# EAGLE design geiger2 (EAGLE 7.5.0)
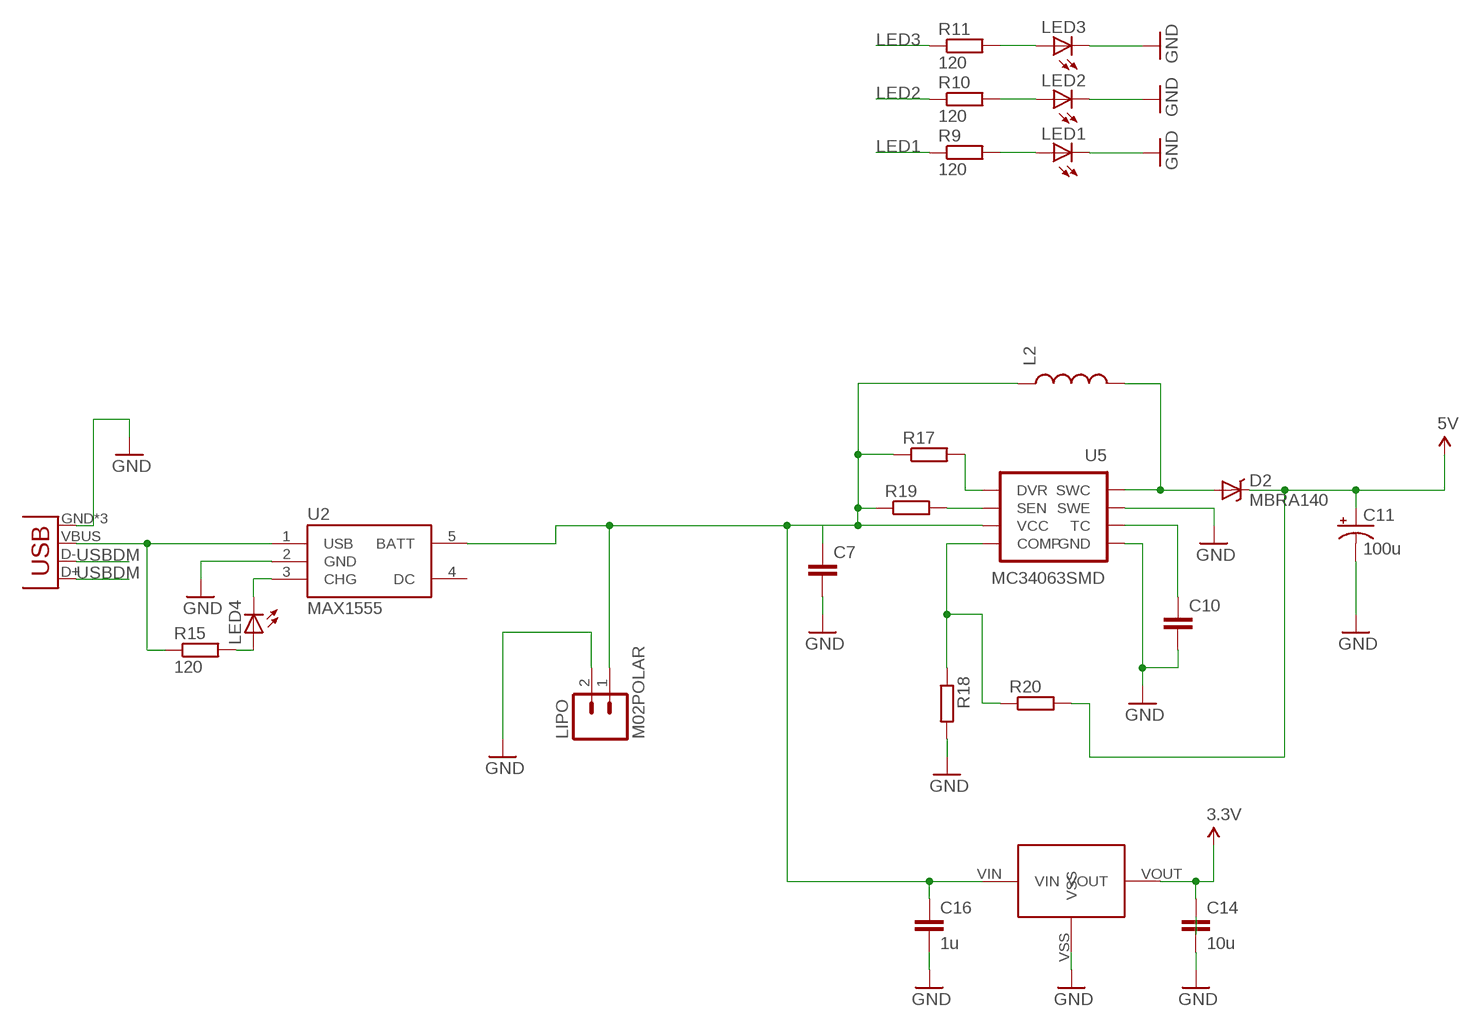
[diagram p0: schematic, sheet 1, part 1 of 2]
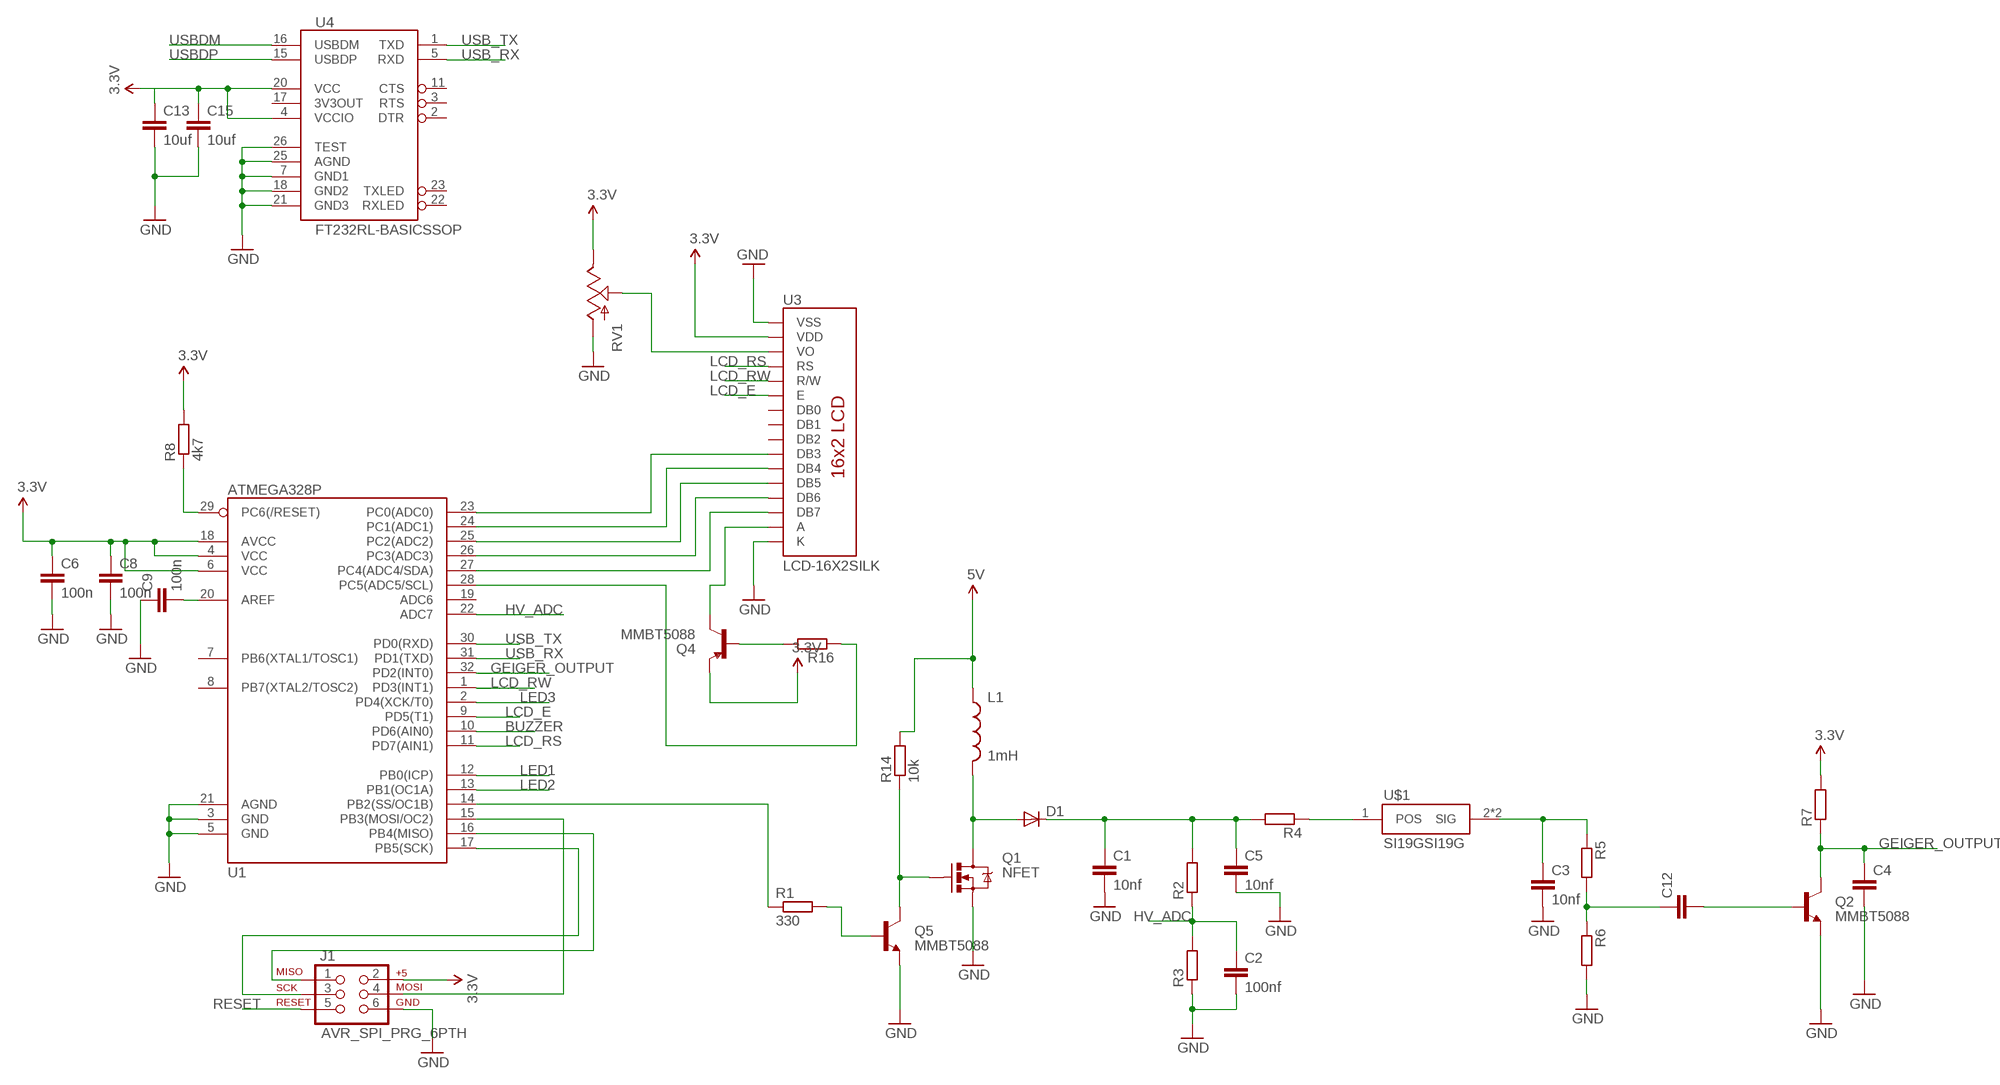
[diagram p1: schematic, sheet 1, part 2 of 2]

## Parts
C1  10nf  C-EU075-032X103  [C075-032X103]
C2  100nf  C-EUC0603  [C0603]
C3  10nf  C-EU075-032X103  [C075-032X103]
C4  C-EUC0603  [C0603]
C5  10nf  C-EU075-032X103  [C075-032X103]
C6  100n  C-EUC0603  [C0603]
C7  C-EUC0805  [C0805]
C8  100n  C-EUC0603  [C0603]
C9  100n  C-EUC0603  [C0603]
C10  C-EUC0603  [C0603]
C11  100u  CAP_POLF80  [NIPPON_F80]
C12  C-EUC0603  [C0603]
C13  10uf  C-EUC0603  [C0603]
C14  10u  C-EUC0603  [C0603]
C15  10uf  C-EUC0603  [C0603]
C16  1u  C-EUC0603  [C0603]
D1  DIODEPTH  [DIODE-1N4001]
D2  MBRA140  [SMA-DIODE]
J1  AVR_SPI_PRG_6PTH  [2X3]
JP2  USB-MICROB  [USB-MICROB]
L1  1mH  INDUCTORRLB0912  [RLB0912]
L2  INDUCTORCR75_V2  [CR75_V2]
LED1  LED0603  [LED-0603]
LED2  LED0603  [LED-0603]
LED3  LED0603  [LED-0603]
LED4  LED0603  [LED-0603]
LIPO  M02POLAR  [MOLEX-1X2]
Q1  NFET  MOSFET-NCHANNELFDD8780  [DPAK]
Q2  MMBT5088  TRANSISTOR_NPNMMBT5088  [SOT23]
Q4  MMBT5088  TRANSISTOR_PNPSMD  [SOT23-3]
Q5  MMBT5088  TRANSISTOR_NPNMMBT5088  [SOT23]
R1  330  R-EU_R0603  [R0603]
R2  R-EU_0207/10  [0207/10]
R3  R-EU_0207/10  [0207/10]
R4  R-EU_0207/10  [0207/10]
R5  R-EU_0207/10  [0207/10]
R6  R-EU_0207/10  [0207/10]
R7  R-EU_R0603  [R0603]
R8  4k7  R-EU_R0603  [R0603]
R9  120  R-EU_R0603  [R0603]
R10  120  R-EU_R0603  [R0603]
R11  120  R-EU_R0603  [R0603]
R14  10k  R-EU_R0603  [R0603]
R15  120  R-EU_R0603  [R0603]
R16  R-EU_R0603  [R0603]
R17  R-EU_R0603  [R0603]
R18  R-EU_R0603  [R0603]
R19  R-EU_R0603  [R0603]
R20  R-EU_R0603  [R0603]
RV1  POT100K_3362U  [3362U]
U1  ATMEGA328P  ATMEGA328_SMT  [TQFP32-08]
U2  MAX1555  [SOT23-5]
U3  LCD-16X2SILK  [LCD-16X2]
U4  FT232RL-BASICSSOP  [SSOP28DB]
U5  MC34063SMD  [SO08]
U$1  SI19GSI19G  [SI19G]
U$2  XC6026  [SOT23]

## Nets
3.3V: C6.1 C8.1 C13.1 C14.1 C15.1 J1.2 Q4.2(E) R7.2 R8.2 RV1.P$1(E) U1.4(VCC) U1.6(VCC) U1.18(AVCC) U3.2(VDD) U4.4(VCCIO) U4.20(VCC) U$2.VOUT
6V: C7.1 C16.1 L2.P$1 LIPO.1 R17.1 R19.1 U2.5(BATT) U5.6(VCC) U$2.VIN
12V: C11.+ D2.C L1.1 R14.2 R20.2 ; supply symbol labelled 5V
BUZZER: U1.10(PD6(AIN0))
GEIGER_OUTPUT: C4.1 Q2.3(C) R7.1 U1.32(PD2(INT0))
GND: C1.2 C2.2 C3.2 C4.2 C5.2 C6.2 C7.2 C8.2 C9.1 C10.2 C11.- C13.2 C14.2 C15.2 C16.2 J1.6 JP2.GND JP2.MT1(GND) JP2.MT2(GND) LED1.C LED2.C LED3.C LIPO.2 Q1.3(S) Q2.2(E) Q5.2(E) R3.1 R6.2 R18.2 RV1.P$3(A) U1.3(GND) U1.5(GND) U1.21(AGND) U2.2(GND) U3.1(VSS) U3.16(K) U4.7(GND1) U4.18(GND2) U4.21(GND3) U4.25(AGND) U4.26(TEST) U5.2(SWE) U5.4(GND) U$2.VSS
HV_ADC: C2.1 R2.1 R3.2 U1.22(ADC7)
LCD_E: U1.9(PD5(T1)) U3.6(E)
LCD_RS: U1.11(PD7(AIN1)) U3.4(RS)
LCD_RW: U1.1(PD3(INT1)) U3.5(R/W)
LED1: R9.1 U1.12(PB0(ICP))
LED2: R10.1 U1.13(PB1(OC1A))
LED3: R11.1 U1.2(PD4(XCK/T0))
N$1: D1.A L1.2 Q1.4(D)
N$2: R1.1 U1.14(PB2(SS/OC1B))
N$3: J1.1 U1.16(PB4(MISO))
N$4: Q5.1(B) R1.2
N$5: J1.3 U1.17(PB5(SCK))
N$6: J1.4 U1.15(PB3(MOSI/OC2))
N$7: C1.1 C5.1 D1.C R2.2 R4.2
N$8: R4.1 U$1.1(POS)
N$9: C3.1 R5.1 U$1.2(SIG) U$1.3(SIG)
N$10: C12.1 R5.2 R6.1
N$11: U1.23(PC0(ADC0)) U3.10(DB3)
N$12: C9.2 U1.20(AREF)
N$13: U1.24(PC1(ADC1)) U3.11(DB4)
N$14: U1.25(PC2(ADC2)) U3.12(DB5)
N$15: U1.26(PC3(ADC3)) U3.13(DB6)
N$16: U1.27(PC4(ADC4/SDA)) U3.14(DB7)
N$17: D2.A L2.P$2 U5.1(SWC)
N$18: RV1.P$2(S) U3.3(VO)
N$19: LED1.A R9.2
N$20: LED2.A R10.2
N$21: LED3.A R11.2
N$22: R18.1 R20.1 U5.5(COMP)
N$23: C12.2 Q2.1(B)
N$24: Q1.1(G) Q5.3(C) R14.1
N$25: Q4.1(B) R16.2
N$26: C10.1 U5.3(TC)
N$29: LED4.A R15.2
N$30: Q4.3(C) U3.15(A)
N$32: R16.1 U1.28(PC5(ADC5/SCL))
N$33: R17.2 U5.8(DVR)
N$34: R19.2 U5.7(SEN)
N$37: LED4.C U2.3(CHG)
N$38: JP2.VBUS R15.1 U2.1(USB)
RESET: J1.5 R8.1 U1.29(PC6(/RESET))
USB_RX: U1.31(PD1(TXD)) U4.5(RXD)
USB_TX: U1.30(PD0(RXD)) U4.1(TXD)
USBDM: JP2.D- U4.16(USBDM)
USBDP: JP2.D+ U4.15(USBDP)
Unconnected: U1.7(PB6(XTAL1/TOSC1)) U1.8(PB7(XTAL2/TOSC2)) U1.19(ADC6) U2.4(DC) U3.7(DB0) U3.8(DB1) U3.9(DB2) U4.2(DTR) U4.3(RTS) U4.11(CTS) U4.17(3V3OUT) U4.22(RXLED) U4.23(TXLED)

## Library data of the parts
C1-C10 C12-C16 = rcl:C-EU: CAPACITOR, European symbol
C11 = SparkFun-Capacitors:CAP_POL: Capacitor Polarized These are standard SMD and PTH capacitors. Normally 10uF, 47uF, and 100uF in electrolytic and tantalum varieties. Always verify the external diameter of the through hole cap, it varies with capacity, voltage, and manufacturer. The EIA devices should be standard.
D1 = SparkFun-DiscreteSemi:DIODE: Diode These are standard reverse protection diodes and small signal diodes. SMA package can handle up to about 1A. SOD-323 can handle about 200mA. What the SOD-323 package when ordering, there are some mfgs out there that are 5-pin packages.
D2 = SparkFun-DiscreteSemi:MBRA140: 40V, 1A Schottky rectifier SMA/DO-214AC package DIO-08053; PROD_ID: DIO-08053
J1 = SparkFun-Connectors:AVR_SPI_PRG_6: AVR ISP 6 Pin This is the reduced ISP connector for AVR programming. Common on Arduino. This footprint will take up less PCB space and can be used with a 10-pin to 6-pin adapter such as SKU: BOB-08508
JP2 = SparkFun-Connectors:USB: USB Connectors USB-B-PTH is fully proven SKU : PRT-00139/CONN-08278 USB-miniB is fully proven SKU : PRT-00587 USB-A-PCB is untested. USB-A-H is throughly reviewed, but untested. Spark Fun Electronics SKU : PRT-00437 USB-B-SMT is throughly reviewed, but untested. Needs silkscreen touching up. USB-A-S has not been used/tested USB-MB-H has not been used/tested USB-MICROB has been used. CONN-09505; PROD_ID: CONN-09505
L1 L2 = SparkFun-Passives:INDUCTOR: Inductors Basic Inductor/Choke - 0603 and 1206. Footprints are not proven and vary greatly between part numbers. SRN6045- 33uH, 20% 1.4A SDR0403-560KL - 56uH, 10%, 500mA RMS/740mA peak
LED1-LED4 = SparkFun-LED:LED: LEDs Standard schematic elements and footprints for 5mm, 3mm, 1206, and 0603 sized LEDs. 5mm - Spark Fun Electronics SKU : COM-00529 (and others)
LIPO = SparkFun-Connectors:M02: Standard 2-pin 0.1" header. Use with - straight break away headers ( PRT-00116) - right angle break away headers (PRT-00553) - swiss pins (PRT-00743) - machine pins (PRT-00117) - female headers (PRT-00115) Molex polarized connector foot print use with: PRT-08233 with associated crimp pins and housings. 2.54_SCREWTERM for use with PRT-10571. 3.5mm Screw Terminal footprints for PRT-08084 5mm Screw Terminal footprints for use with PRT-08433
Q1 = SparkFun-DiscreteSemi:MOSFET-NCHANNEL: Common NMOSFET Parts MFG P/N Store ID Prod ID FDD8780 TRANS-09984 SI7820DN TRANS-11055 FDS6630A IC-08089 2N7002PW TRANS-11151 FQP30N06L COM-10213 TRANS-10060 BSS123LT1G TRANS-08345 BSS138 TRANS-00830 BS170 2N7000; PROD_ID: TRANS-09984
Q2 Q5 = SparkFun-DiscreteSemi:TRANSISTOR_NPN: Generic NPN BJT MMBT2222A - TRANS-08049 (SOT-23, 1A 40V) MPSA42 - TRANS-09116 (SOT-23, 500mA 300V) MMBT5088LT1G - TRANS-11160 (SOT-23, 50 mA 30V); PROD_ID: TRANS-11160
Q4 = SparkFun-DiscreteSemi:TRANSISTOR_PNP: Generic PNP BJT Double check pinouts against datasheets- not all devices are the same! MMBT3906 - 40V 200mA SOT-23 (TRANS-08052) MMBT4403 - 40V 600mA SOT-23 (TRANS-09245)
R1-R11 R14-R20 = rcl:R-EU_: RESISTOR, European symbol
RV1 = SparkFun-Electromechanical:POT
U1 = SparkFun-DigitalIC:ATMEGA328_SMT: 32-Pin Atmega328 part Commonly used on Arduino compatible boards Available in QFP and QFN packages TQFP is IC-09069 QFN is non-stock; PROD_ID: IC-09069
U2 = SparkFun-PowerIC:MAX1555: MAX1555 Lithium Charger IC SOT-23 Lithium Polymer charging IC. Schematic element and footprint proven. Spark Fun Electronics SKU : COM-00674
U3 = SparkFun-Displays:LCD-16X2: Standard text-only 16x2 parallel input LCD
U4 = SparkFun-DigitalIC:FT232RL-BASIC: USB UART This is the simplified version of the FT232RL unit. Only what you need, nothing you don't. Spark Fun Electronics SKU : COM-00650
U5 = SparkFun-PowerIC:MC34063: Jellybean switching supply controller
U$1 = geiger_tubes:SI19G
U$2 = henriks_egne_pakker:XC6026

## Board
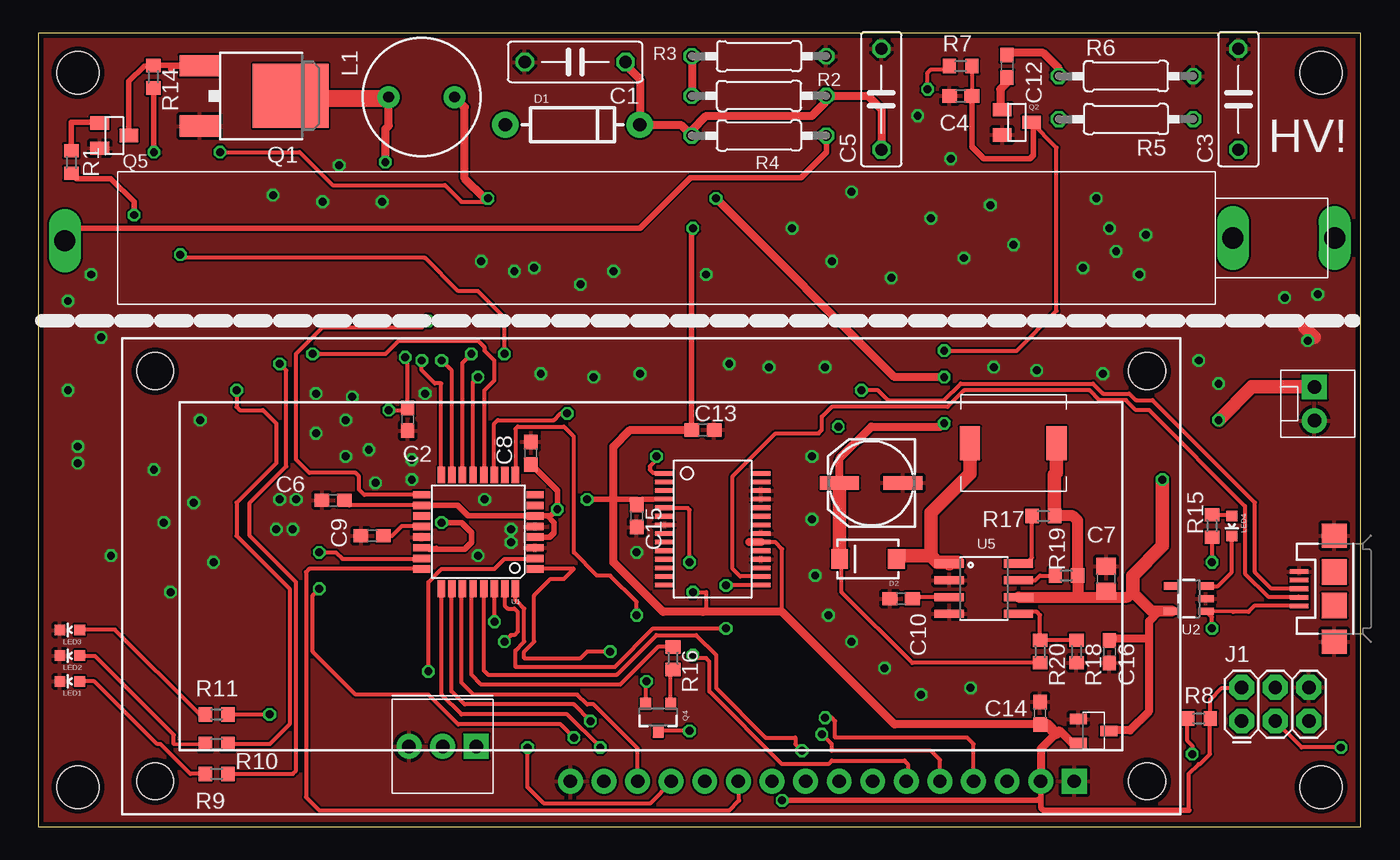
[diagram p2: board, top side]
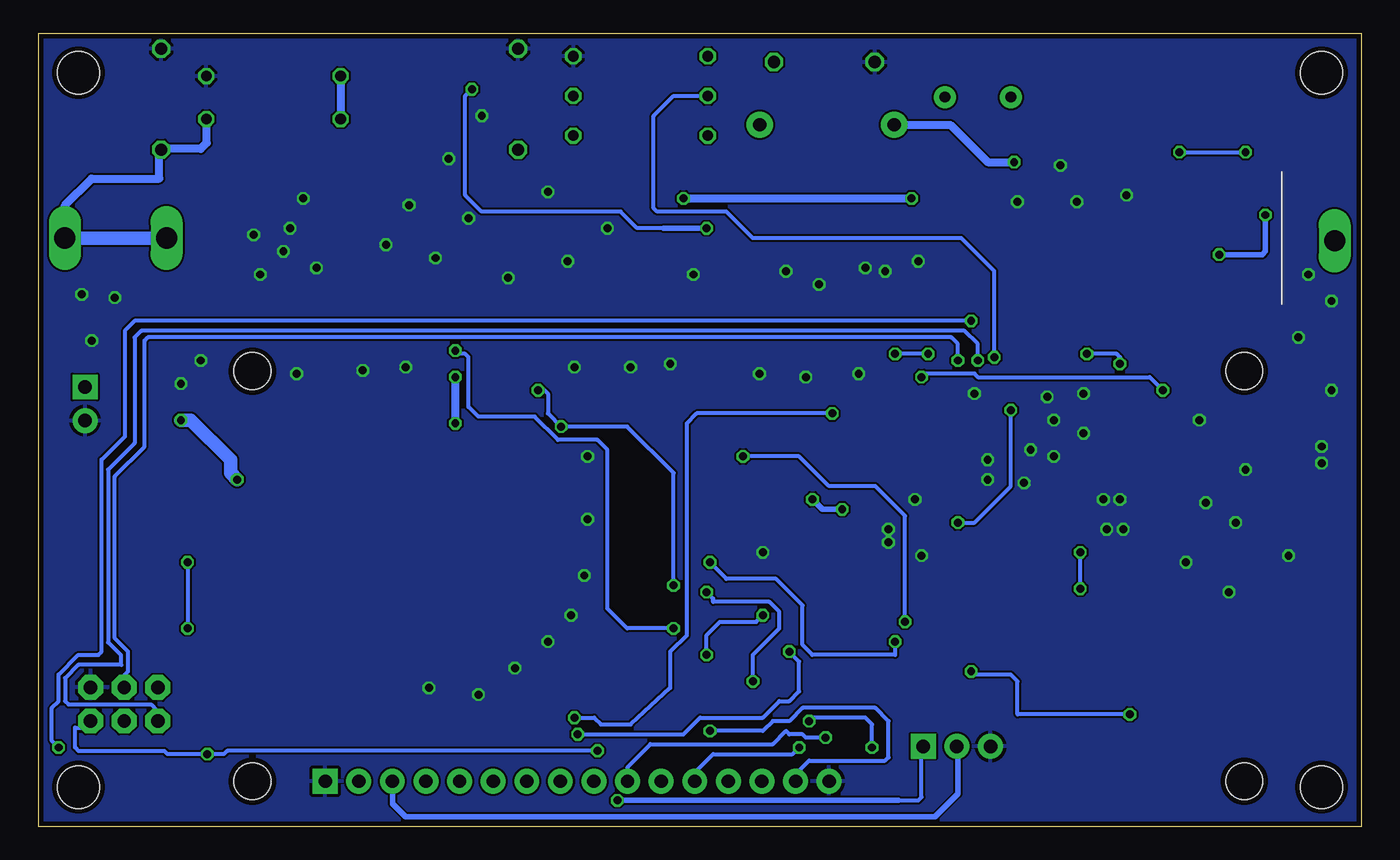
[diagram p3: board, bottom side, seen from below]

Size 100 x 60 mm. Coordinates in mm from the lower left corner, seen from the top.
Outline: 0,0 100,0 100,60 0,60 0,0
Copper layers (1*16): Top 0.0356mm / dielectric 1.5011mm / Bottom 0.0356mm
Design rules "osh_park": minimum track width 6mil, minimum drill 13mil, track to track 6mil, track to pad 6mil, pad to pad 6mil, via to via 6mil, smd to smd 6mil, copper to edge 15mil, drill to drill 6mil, minimum pad ring 7mil, minimum via ring 7mil, stop-mask expansion 3mil, vias tented up to drill 0mil, thermal gap 10mil
Holes 3.2 mm at 3,57 97,57 3,3 97,3

### Footprints (pad centres in the part's own frame; a part is rotated, then mirrored left to right if it is on the bottom)
C075-032X103 = drill 0.914 octagon: 1 -3.81,0; 2 3.81,0
C0603 = smd 1.1 x 1: 1 -0.85,0; 2 0.85,0
C0805 = smd 1.3 x 1.5: 1 -0.95,0; 2 0.95,0
NIPPON_F80 = smd 2.95 x 1: + 2.4,0; - -2.4,0
DIODE-1N4001 = drill 1 pad 1.981: A -5.08,0; C 5.08,0
SMA-DIODE = smd 1.27 x 1.47: A -2.15,0; C 2.15,0
2X3 = drill 1.016 pad 1.88 octagon: 1 0,0; 2 0,2.54; 3 2.54,0; 4 2.54,2.54; 5 5.08,0; 6 5.08,2.54
USB-MICROB = smd 0.35 x 1.4: D+ 0,2.65; D- -0.65,2.65; GND 1.3,2.65; ID 0.65,2.65; VBUS -1.3,2.65 | smd 1.8 x 1.9: MT1 -4,0; MT2 4,0 | smd 1.9 x 1.9: P$1 -1.27,0; P$2 1.27,0
RLB0912 = drill 0.813 pad 1.651: 1 2.502,0; 2 -2.502,0
CR75_V2 = smd 1.524 x 2.54: P$1 -0.254,0; P$2 6.304,0
LED-0603 = smd 0.8 x 0.8: A 0,-0.75; C 0,0.75
MOLEX-1X2 = drill 1.016 pad 1.88 square: 1 0,0 | drill 1.016 pad 1.88: 2 2.54,0
DPAK = smd 1.6 x 3: 1 -2.28,-5.31; 3 2.28,-5.31 | smd 4.826 x 5.715: 4 0,1.588
SOT23 = smd 1 x 1.4: 1 -0.95,-1.1; 2 0.95,-1.1; 3 0,1.1
SOT23-3 = smd 0.8 x 0.9: 1 -0.95,-1; 2 0.95,-1; 3 0,1.1
R0603 = smd 1 x 1.1: 1 -0.85,0; 2 0.85,0
0207/10 = drill 0.813 octagon: 1 -5.08,0; 2 5.08,0
3362U = drill 1.016 pad 1.88 square: P$1 0,2.54 | drill 1.016 pad 1.88: P$2 2.54,2.54; P$3 5.08,2.54
TQFP32-08 = smd 1.27 x 0.559: 1 -4.293,2.8; 2 -4.293,2; 3 -4.293,1.2; 4 -4.293,0.4; 5 -4.293,-0.4; 6 -4.293,-1.2; 7 -4.293,-2; 8 -4.293,-2.8; 17 4.293,-2.8; 18 4.293,-2; 19 4.293,-1.2; 20 4.293,-0.4; 21 4.293,0.4; 22 4.293,1.2; 23 4.293,2; 24 4.293,2.8 | smd 0.559 x 1.27: 9 -2.8,-4.293; 10 -2,-4.293; 11 -1.2,-4.293; 12 -0.4,-4.293; 13 0.4,-4.293; 14 1.2,-4.293; 15 2,-4.293; 16 2.8,-4.293; 25 2.8,4.293; 26 2,4.293; 27 1.2,4.293; 28 0.4,4.293; 29 -0.4,4.293; 30 -1.2,4.293; 31 -2,4.293; 32 -2.8,4.293
SOT23-5 = smd 0.55 x 1.2: 1 -0.95,-1.3; 2 0,-1.3; 3 0.95,-1.3; 4 0.95,1.3; 5 -0.95,1.3
LCD-16X2 = drill 1.016 pad 1.88 square: 1 -32,15.5 | drill 1.016 pad 1.88: 2 -29.46,15.5; 3 -26.92,15.5; 4 -24.38,15.5; 5 -21.84,15.5; 6 -19.3,15.5; 7 -16.76,15.5; 8 -14.22,15.5; 9 -11.68,15.5; 10 -9.14,15.5; 11 -6.6,15.5; 12 -4.06,15.5; 13 -1.52,15.5; 14 1.02,15.5; 15 3.56,15.5; 16 6.1,15.5 | hole 2.8: -37.5,15.5; -37.5,-15.5; 37.5,15.5; 37.5,-15.5
SSOP28DB = smd 0.348 x 1.397: 1 -4.225,-3.656; 2 -3.575,-3.656; 3 -2.925,-3.656; 4 -2.275,-3.656; 5 -1.625,-3.656; 6 -0.975,-3.656; 7 -0.325,-3.656; 8 0.325,-3.656; 9 0.975,-3.656; 10 1.625,-3.656; 11 2.275,-3.656; 12 2.925,-3.656; 13 3.575,-3.656; 14 4.225,-3.656; 15 4.225,3.656; 16 3.575,3.656; 17 2.925,3.656; 18 2.275,3.656; 19 1.625,3.656; 20 0.975,3.656; 21 0.325,3.656; 22 -0.325,3.656; 23 -0.975,3.656; 24 -1.625,3.656; 25 -2.275,3.656; 26 -2.925,3.656; 27 -3.575,3.656; 28 -4.225,3.656
SO08 = smd 0.61 x 2.21: 1 -1.905,-2.616; 2 -0.635,-2.616; 3 0.635,-2.616; 4 1.905,-2.616; 5 1.905,2.616; 6 0.635,2.616; 7 -0.635,2.616; 8 -1.905,2.616
SI19G = drill 1.6 long: 1 -46.99,-0.19; 2 41.33,0.005; 3 49.03,0.005
SOT23' = smd 0.8 x 1.3: VIN 0,1.2; VOUT 0.9,-1.1; VSS -0.9,-1.1

### Placement (x,y rotation side)
C1  40.6,57.81 180 top
C2  27.94,30.8 270 top
C3  90.75,55 90 top
C4  69.75,55.25 180 top
C5  63.75,55 90 top
C6  22.3,24.68 180 top
C7  80.75,18.75 90 top
C8  37.25,28.25 90 top
C9  25.25,22 0 top
C10  65.25,17.25 180 top
C11  63,26 180 top
C12  73.25,57.5 270 top
C13  50.25,30 0 top
C14  75.75,8.6 90 top
C15  45.25,23.5 270 top
C16  81,13.25 270 top
D1  40.4,53.07 0 top
D2  62.75,20.25 180 top
J1  91,8 0 top
JP2  98,18 90 top
L1  28.99,55.16 0 top
L2  76.75,29 180 top
LED1  2.39,11 90 top
LED2  2.39,12.94 90 top
LED3  2.39,14.88 90 top
LED4  90.25,22.75 180 top
LIPO  96.5,33.25 270 top
Q1  17.5,55.25 270 top
Q2  74,53.25 270 top
Q4  46.87,8.3 180 top
Q5  5.75,52.25 270 top
R1  2.5,50.25 90 top
R2  54.5,55.25 0 top
R3  54.5,58.25 180 top
R4  54.5,52.25 180 top
R5  82.25,53.5 180 top
R6  82.25,56.75 0 top
R7  69.75,57.5 180 top
R8  87.77,8.19 0 top
R9  13.5,4 180 top
R10  13.5,6.25 180 top
R11  13.5,8.5 180 top
R14  8.7,56.7 270 top
R15  88.75,22.75 90 top
R16  48,12.75 270 top
R17  76,23.5 180 top
R18  78.5,13.25 270 top
R19  77.75,19 180 top
R20  75.75,13.25 270 top
RV1  33.12,8.63 180 top
U1  33.28,22.3 180 top
U2  87,17.25 90 top
U3  46.34,18.95 180 top
U4  51,22.5 270 top
U5  71.5,18 270 top
U$1  49,44.5 0 top
U$2  XC6026  [SOT23']  79.75,7.25 270 top

### Tracks (layer width: path | path; a pad name or v marks a point on that pad's centre or on a via)
3.3V  (via drill 0.6)
  Top 0.305: U1.18 23.53,24.3 C6.1 | 87,1.25 87,4 87.75,4.75 87.85,4.75 88.6,5.5 88.6,8.17 R8.2 88.62,9.62 89.5,10.5 90.96,10.5 J1.2 | U$2.VOUT 78.15,6.35 | 56.25,16.25 56.25,21 55.75,21.5 54.68,21.5 U4.20 | U4.4 46.48,24.77 | C15.1 45.25,24.5 | v49.5,17.75 50.5,17.75 50.5,16.5 50.25,16.25 | v67.25,55.75 67.25,57 67.5,57.25 68.65,57.25 R7.2 | 45.92,10.92 Q4.2
  Top 0.406: U3.2 75.8,2.25 | 75.8,2.25 75.8,1.45 76,1.25 87,1.25 | C13.1 49.4,45.15 v49.5,45.25 | 46.48,24.77 45.67,24.77 C15.1 45.25,24.75 43.5,24.75 | 43.5,24.75 43.5,23.25 | U1.4 38.65,21.9 39,22.25 39,23 38.5,23.5 U1.6 | v41.5,24.75 43.5,24.75 | U1.6 38.75,23.5 v39.25,24 39.25,25.4 C8.1 | U1.6 32.5,23.5 31.7,24.3 U1.18 | v56.25,2 75.55,2 75.8,2.25 | 45.92,10.92 v46,11
  Top 0.61: U3.2 75.8,5.9 76.95,7.05 77.2,7.3 78.15,6.35 | C14.1 64.75,7.75 56.25,16.25 50.25,16.25 47.25,16.25 43.5,20 43.5,24.75 43.5,28.75 44.75,30 C13.1 | U4.20 53.77,21.52
  Top 0.813: C14.1 76.25,7.75 76.95,7.05
  Bottom 0.305: v46,11 46,13 44,15 44,16.25 44.75,17 49,17 49,17.25 v49.5,17.75 | RV1.P$1 33.18,6.03 33.18,5.49 33.25,5.42 33.25,2.25 33.5,2 35,2 | 52.75,45.25 54.75,45.25 56,46.5 66.5,46.5 67.75,47.75 67.75,55.25 v67.25,55.75
  Bottom 0.406: v39.25,24 40.75,24 v41.5,24.75 | 35,2 v56.25,2 | v49.5,45.25 52.75,45.25
6V  (via drill 0.6)
  Top 0.305: U$2.VIN 81,7.3
  Top 0.61: 80.75,7.3 81,7.3 82.55,7.3 84,8.75 84,14.25 | 84.75,16.3 84,15.55 84,14.25 | C16.1 81.15,14.25 84,14.25
  Top 0.813: U2.5 84.75,16.3 84.2,16.3 82.75,17.75 82.36,17.36 81,17.36 | U5.6 78.75,17.36 | 78.75,17.36 81,17.36 | 78.75,17.36 78.6,17.52 R19.1 78.6,23.15 78.25,23.5 R17.1 | C7.1 80.75,17.61 81,17.36
  Top 1.016: R17.1 76.85,26.6 77,26.75 L2.P$1 | v85,26.25 85,21.25 82.75,19 82.75,17.75 | v89.25,30.75 91.75,33.25 LIPO.1
  Bottom 1.016: v89.25,30.75 88.5,30.75 85.5,27.75 85.5,26.75 v85,26.25
12V  (via drill 0.6)
  Top 0.305: R20.2 66.1,12.4 60.75,17.75 60.75,20.1 D2.C | 8.75,55.8 R14.2 | 32,55.1 L1.1 | v13.75,51 19.75,51 22.25,48.5 30.75,48.5 32,47.25 33.75,47.25 v34,47.5
  Top 0.406: 8.75,55.8 v8.75,51
  Top 0.61: C11.+ 60.6,27.85 63,30.25 68.25,30.25 v68.5,30.5 | v68.5,34 64.75,34 v51.25,47.5 | v34,47.5 33.75,47.5 32.25,49 32.25,54.4 L1.1
  Top 1.016: D2.C C11.+
  Bottom 0.305: v13.75,51 v8.75,51
  Bottom 0.61: v68.5,30.5 v68.5,34 | v51.25,47.5 v34,47.5
GEIGER_OUTPUT  (via drill 0.6)
  Top 0.305: v52,15 46.5,15 43.6,12.1 36.1,12.1 36.08,12.12 36.08,13.33 36.75,14 36.75,16.5 36.25,17 36.2,17 36.1,17.1 36.1,17.99 U1.32 | v68.5,36 74,36 77,39 77,51.35 Q2.3 | R7.1 C4.1
  Top 0.406: C4.1 70.6,51.4 71.5,50.5 75,50.5 75.25,50.75 75.25,53.1 Q2.3
  Bottom 0.305: v52,15 55.5,15 57,16.5 57,28.5 57.75,29.25 60.75,29.25 62.5,31 66.75,31 67.5,31.75 67.5,35.5 67.75,35.75 68.25,35.75 v68.5,36
GND  (via drill 0.6)
  Top 0.305: U1.21 29.1,21.9 29.25,21.75 | U1.3 37.9,21.1 38,21
  Top 1.016: 96.5,37 95.75,37.75
  other vias: 18,22.5 19.25,22.5 18.25,24.75 19.5,24.75 28.25,27.75 23.25,28 28.25,26.25 29.25,32.75 25.5,26 23.25,30.75 23.75,32.5 21,32.75 21,29.75 25,28.5 33.25,20.5 35.75,21.5 35.75,22.5 33.75,24.75 45.25,20.75 3,27.5 3,28.75 2.25,33 4.75,37 2.25,39.75 4,41.75 12.25,30.75 8.75,27 11.75,24.5 9.5,23 13.25,20 10,17.75 5.5,20.5 41,41 37.5,42.25 36,42 33.5,42.75 26,47.25 21.5,47.25 17.75,47.75 22.75,50 43.5,42 50.5,41.75 57,45.25 60,42.75 61.5,48 64.5,41.5 67.5,46 70,43 73.75,44 72,47 69,50.5 66.5,53.75 79,42.25 81,45.25 80,47.5 83.75,44.75 81.5,43.5 83.25,41.75 94.25,40 96.75,40.25 96,36.75 89.25,33.5 87.75,35.25 80.5,34.25 75.5,34.5 72.25,34.75 59.5,34.75 55.25,34.75 52.25,35 59.75,16 61.5,14 64,12 66.75,10 70.5,10.5 58.75,19 58.5,23.25 58.5,28 45.5,34.25 42,34 38,34.25
  pour Top: 0,60 0,0 100,0 100,60
  pour Bottom: 0,60 0,0 100,0 100,60
HV_ADC  (via drill 0.6)
  Top 0.305: U1.22 29.5,21.1 30.1,21.1 | v26.5,31.5 27.79,31.5 C2.1 27.94,35.31 v27.75,35.5
  Top 0.406: v30.5,23 32,23 32.75,22.25 32.75,21.5 32.25,21 29.6,21 29.5,21.1
  Top 0.61: R3.2 R2.1 49.5,55.25
  Bottom 0.305: v30.5,23 29.25,23 26.5,25.75 v26.5,31.5 | v27.75,35.5 27.75,42 30.25,44.5 46,44.5 48,46.5 53.25,46.5 53.5,46.75 53.5,53.75 52,55.25 R2.1
LCD_E  (via drill 0.6)
  Top 0.305: U1.9 36.08,30.08 36.25,30.25 39.75,30.25 40.5,29.5 40.5,20.75 42.25,19 43.25,19 45.25,17 v45.25,16 | v49.5,13 49.75,12.75 50.5,12.75 50.75,12.5 50.75,10.25 56.25,4.75 59.75,4.75 60,5 65.5,5 65.75,4.75 65.75,3.56 U3.6
  Bottom 0.305: v49.5,13 49.5,14.5 48.5,15.5 45.75,15.5 v45.25,16
LCD_RS  (via drill 0.6)
  Top 0.305: U1.11 34.48,30.48 34.75,30.75 39,30.75 39.5,31.25 v40,31.25 | U3.4 70.72,6.28 70.25,6.75 60.25,6.75 60.25,8 60,8.25 v59.5,8.25
  Bottom 0.305: v40,31.25 50.25,31.25 51,30.5 51,14.5 52.25,13.25 52.25,10.5 55.25,7.75 57.5,7.75 58,8.25 v59.5,8.25
LCD_RW  (via drill 0.6)
  Top 0.305: U3.5 68.18,5.07 67.5,5.75 60,5.75 60,6.25 v59.25,7 | v43.25,13.25 41.5,13.25 41,12.75 36.75,12.75 36.75,13.25 37.5,14 37.5,17.5 38.75,18.75 39.75,18.75 40.5,19.5 U1.1
  Bottom 0.305: v43.25,13.25 42.5,12.5 42.5,10.25 43.25,9.5 44,9.5 45.25,8.25 50,8.25 51.25,7 v59.25,7
LED1  (via drill 0.6)
  Top 0.305: R9.1 19.25,4 19.5,4.25 19.5,18.5 16,22 16,24.5 18.75,27.25 18.75,34.5 v18.25,35 | v20.75,35.75 26.25,35.75 27.25,36.75 33.25,36.75 33.75,36.25 33.75,36 34.5,35.25 34.5,33.75 33.75,33 33.75,26.66 U1.12
  Bottom 0.305: v18.25,35 18.25,35.5 18.5,35.75 v20.75,35.75
LED2  (via drill 0.6)
  Top 0.305: v15,33 15,31.75 15.25,31.5 17,31.5 18,30.5 18,27.5 15,24.5 15,22 19,18 19,7.75 17.5,6.25 R10.1 | U1.13 32.88,33.63 v33.25,34
  Bottom 0.305: v15,33 16,34 29,34 29.25,34.25 33,34.25 v33.25,34
LED3  (via drill 0.6)
  Top 0.305: 37.62,20.25 U1.2 37.52,20.25 35.25,20.25 34.5,19.5 30.5,19.5 29.5,18.5 v29.5,11.75 | R11.1 v17.5,8.5
  Bottom 0.305: v17.5,8.5 26,8.5 26,11 26.5,11.5 29.25,11.5 v29.5,11.75
N$1  (via drill 0.6)
  Top 0.61: v26.25,50.25 26.25,52.75 26.5,53 26.5,55.15 L1.2
  Top 1.27: Q1.4 18.5,55.25 18.66,55.09 26.42,55.09 L1.2
  Bottom 0.61: D1.A 31.07,53.07 28.25,50.25 v26.25,50.25
N$2  (via drill 0.6)
  Top 0.305: v10.75,43.25 11,43 29.25,43 31.75,40.5 33.25,40.5 35.25,38.5 v35.25,35.75 | U1.14 32.08,35.08 v32.75,35.75
  Top 0.406: v7.25,46.25 7.25,47.25 5.5,49 2.9,49 R1.1
  Bottom 0.305: v32.75,35.75 v35.25,35.75
  Bottom 0.406: v7.25,46.25 7.25,43.5 7.5,43.25 v10.75,43.25
N$3  (via drill 0.6)
  Top 0.305: U1.16 30.48,33.52 29.98,33.52 29,34.5 v29,35.25
  Bottom 0.305: v29,35.25 29,36.5 30,37.5 92.25,37.5 92.75,37 92.75,29 94.75,27 94.75,13.95 93.8,13 93.8,12.3 93.75,12.25 97,12.25 98,11.25 98,9.5 97.75,9.25 91.5,9.25 91,8.75 J1.1
N$4
  Top 0.406: R1.2 2.5,53.25 4.6,53.25 Q5.1
N$5  (via drill 0.6)
  Top 0.305: v29.5,38.25 29,37.75 21.5,37.75 19.5,35.75 19.5,27.75 20.5,26.75 24,26.75 24.25,26.5 24.25,25.5 24.65,25.1 U1.17 | v98.5,6 95.54,6 J1.3
  Bottom 0.305: v29.5,38.25 92.75,38.25 93.5,37.5 93.5,29.5 95.25,27.75 95.25,13.25 95.5,13 97,13 98.5,11.5 98.5,9.5 99,9 99,6.5 v98.5,6
N$6  (via drill 0.6)
  Top 0.305: U1.15 31.28,34.47 v30.5,35.25
  Bottom 0.305: v30.5,35.25 30.5,36.5 31,37 91.75,37 92,36.75 92,28.75 94.25,26.5 94.25,14.25 93.25,13.25 93.25,11.75 93.54,11.46 J1.4
N$7
  Top 0.61: C1.1 44.41,57.59 45.5,56.5 45.5,53.09 D1.C 48.6,53.07 R4.2 49.42,52.67 50.5,53.75 58.5,53.75 59.5,54.75 59.5,55.17 R2.2 62.75,55.25 63.75,54.25 C5.1
N$8
  Top 0.406: U$1.1 2.95,45.25 45.5,45.25 49.31,49.06 57.66,49.06 59.6,51 59.6,52.23 R4.1
N$9
  Bottom 0.61: U$1.3 98.03,46.97 96,49 90.89,49 90.89,51.05 C3.1 90.69,51.25 87.75,51.25 87.3,51.7 87.3,53.47 R5.1
  Bottom 1.016: 89.75,44.51 U$1.2 U$1.3
N$10
  Top 0.61: R6.1 77.17,57.33 76,58.5 73.4,58.5 C12.1
  Bottom 0.61: R6.1 R5.2
N$11  (via drill 0.6)
  Top 0.305: v40.5,6.75 39.5,7.75 31.75,7.75 29.5,10 24,10 20.75,13.25 20.75,17.5 v21.25,18 | v21.25,20.75 22.5,20.75 23,20.25 28.94,20.25 U1.23
  Bottom 0.305: U3.10 55.48,4.52 53.75,6.25 44.5,6.25 43.5,7.25 43.25,7 42.25,7 42,6.75 v40.5,6.75 | v21.25,18 v21.25,20.75
N$12
  Top 0.305: C9.2 26.75,22 27.5,22.75 28.94,22.75 U1.20
N$13
  Top 0.305: U1.24 20.5,19.5 20.25,19.25 20.25,2.25 21.25,1.25 52.25,1.25 53,2 53,3.39 U3.11
N$14  (via drill 0.6)
  Top 0.305: v42.5,6 40,8.5 32,8.5 30.5,10 30.5,17.99 U1.25
  Bottom 0.305: U3.12 50.4,4.1 49,5.5 43,5.5 v42.5,6
N$15  (via drill 0.6)
  Top 0.305: U3.13 47.86,3.36 46.25,1.75 38.25,1.75 37,3 v37,6 | U1.26 31.25,17.98 31.25,10.25 32.25,9.25 40.5,9.25 v41.75,8
  Bottom 0.305: v37,6 37,7.75 37.5,8.25 41.5,8.25 v41.75,8
N$16
  Top 0.305: U3.14 45.32,5.93 42,9.25 41.5,9.25 40.75,10 32.9,10 32,10.9 32,17.93 U1.27
N$17
  Top 1.016: 67.5,20.5 67.5,23.75 70.45,26.7 L2.P$2 | 67.5,20.5 68,20 68.98,20 | 69.5,20 68.98,20 | 68.98,20 U5.1 | 67.5,20.5 65.15,20.5 D2.A
N$18
  Bottom 0.406: U3.3 73.25,1.75 72.25,0.75 32.25,0.75 30.5,2.5 30.5,6.01 RV1.P$2
N$19
  Top 0.305: R9.2 11.5,4 9.25,6.25 9,6.25 4.25,11 LED1.A
N$20
  Top 0.254: 10.25,6.25 R10.2
  Top 0.305: 10.25,6.25 10.25,6.95 4.3,12.9 3.18,12.9 LED2.A
N$21
  Top 0.305: R11.2 12.2,8.5 5.8,14.9 3.16,14.9 LED3.A
N$22
  Top 0.305: R18.1 R20.1 75.75,16 75.5,16.25 74.27,16.25 U5.5
N$23
  Top 0.61: C12.2 73.25,56.25 72.75,55.75 72.75,54.35 Q2.1
N$24
  Top 0.406: 10,57.25 10.25,57.5 10.75,57.5 | 10.75,57.5 12.16,57.5 Q1.1 | 10.75,57.5 10.7,57.55 R14.1 8.65,57.5 8,57.5 6.85,56.35 Q5.3
N$25
  Top 0.305: Q4.1 47.82,11.72 R16.2
N$26
  Top 0.305: U5.3 66.22,17.36 C10.1
N$29
  Top 0.305: R15.2 90.15,23.6 LED4.A
N$30  (via drill 0.6)
  Top 0.305: v49.25,7.25 47,7.25 46.92,7.25 46.75,7.25 46.8,7.2 Q4.3
  Bottom 0.305: 42.8,3.45 U3.15 42.78,3.97 41.75,5 36,5 35.75,5.25 35.75,8 36.75,9 42.25,9 43.25,8 44.5,8 45.25,7.25 v49.25,7.25
N$32
  Top 0.305: R16.1 46.85,13.6 44,10.75 33.5,10.75 32.75,11.5 32.75,17.88 U1.28
N$33
  Top 0.305: U5.8 74.7,19.91 75.15,20.35 R17.2
N$34
  Top 0.305: U5.7 75.39,18.64 75.75,19 R19.2
N$37
  Top 0.305: U2.3 89.2,18.2 90.25,19.25 LED4.C
N$38  (via drill 0.6)
  Top 0.305: JP2.VBUS 91.95,16.7 91.5,16.25 90.35,16.25 U2.1 88.75,15.85 v88.75,15 | R15.1 v88.75,20
  Bottom 0.305: v88.75,20 v88.75,15
RESET  (via drill 0.6)
  Top 0.305: U1.29 33.68,11.82 34,11.5 43.75,11.5 46.75,14.5 49.75,14.5 51.25,13 51.25,10.5 55,6.75 57.25,6.75 57.25,6.25 v57.75,5.75 | R8.1 86.9,8.17 86.9,6.5 87.25,6.15 v87.25,5.5
  Bottom 0.305: J1.5 96.58,7.5 97.25,7.5 97.25,6 97,5.75 90.5,5.75 90.25,5.5 v87.25,5.5 86,5.5 85.75,5.75 v57.75,5.75
USB_RX  (via drill 0.6)
  Top 0.305: U1.31 35.28,16.72 35.5,16.5 36,16.5 36.25,16.25 36.25,14.75 36,14.5 35.75,14.5 v35.25,14 | v49.25,20 49.25,23.95 49.1,24.1 47.37,24.1 U4.5
  Bottom 0.305: v35.25,14 35.25,13 41.5,13 42.25,13.75 42.25,16.75 44.25,18.75 48,18.75 v49.25,20
USB_TX  (via drill 0.6)
  Top 0.305: U1.30 34.48,16.52 v34.5,15.5 | v46.75,28 46.75,27.75 46.25,27.25 46.25,27 46.5,26.75 47.32,26.75 U4.1
  Bottom 0.305: v34.5,15.5 34.5,23.5 36.75,25.75 40.25,25.75 42.5,28 v46.75,28
USBDM
  Top 0.305: JP2.D- 95.3,17.4 93,17.4 91.25,19.15 91.25,24.25 84,31.5 83,31.5 82.25,32.25 80.25,32.25 79.5,33 70,33 68.75,31.75 60,31.75 59.25,31 59.25,30 59,29.75 55.75,29.75 52.5,26.5 52.5,19.5 53.08,18.93 U4.16
USBDP  (via drill 0.6)
  Top 0.305: JP2.D+ 93.25,18 92,19.25 92,24.5 84.25,32.25 83,32.25 82.5,32.75 80.5,32.75 79.75,33.5 69.75,33.5 68.5,32.25 64.25,32.25 63.5,33 v62.25,33 | v60.5,30.25 60.5,30.2 | U4.15 52.02,18.27 v52,18.25
  Bottom 0.305: v62.25,33 61.75,33 61.5,32.75 61.5,31.25 v60.5,30.25 55.5,30.25 52,26.75 v52,18.25

### Text on the board
_tsilk: HV!